# Altium schematic sheet jitx-top.SchDoc
size 558 x 431 mm
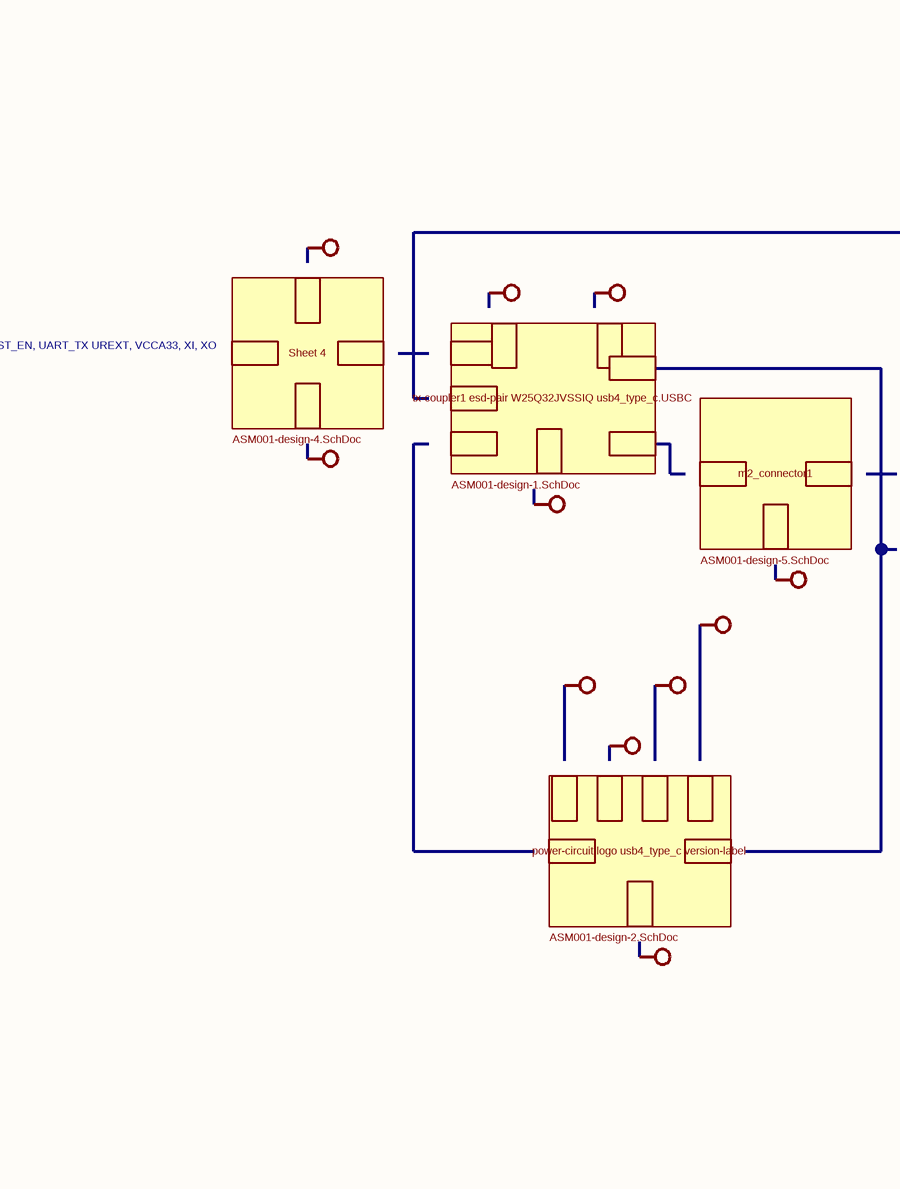
[diagram p0: jitx-top.SchDoc, centre column 2 of 4]
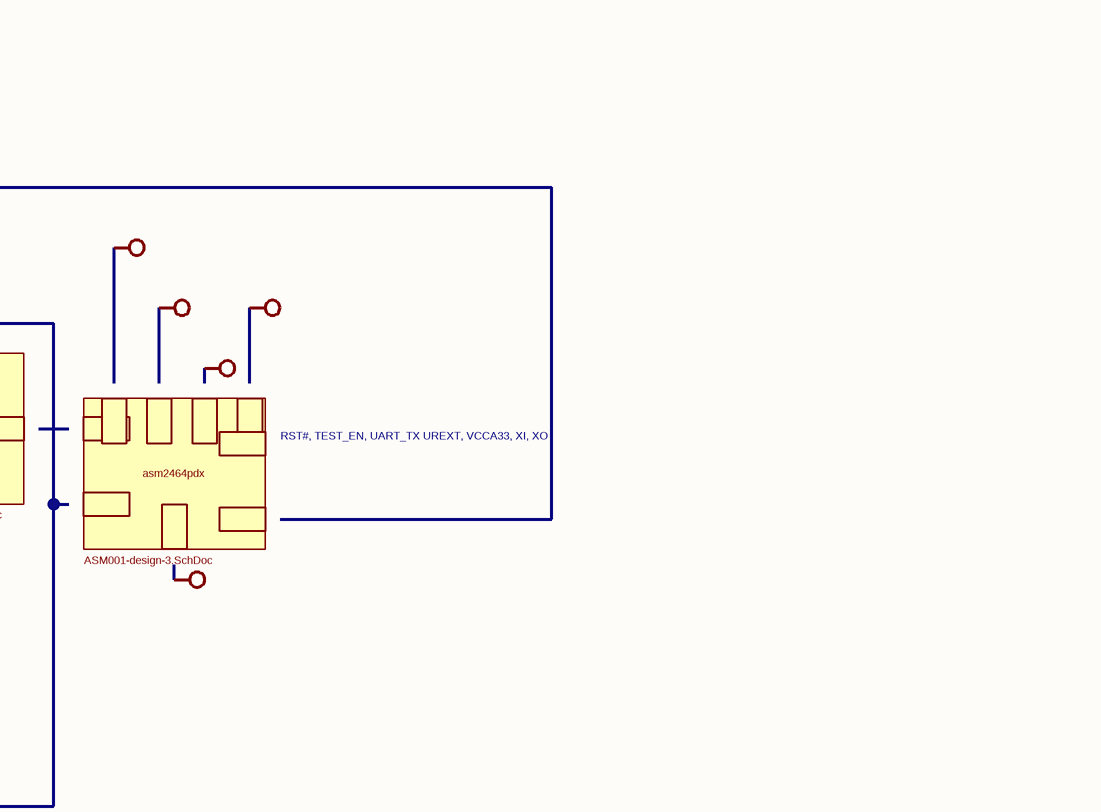
[diagram p1: jitx-top.SchDoc, centre column 3 of 4]
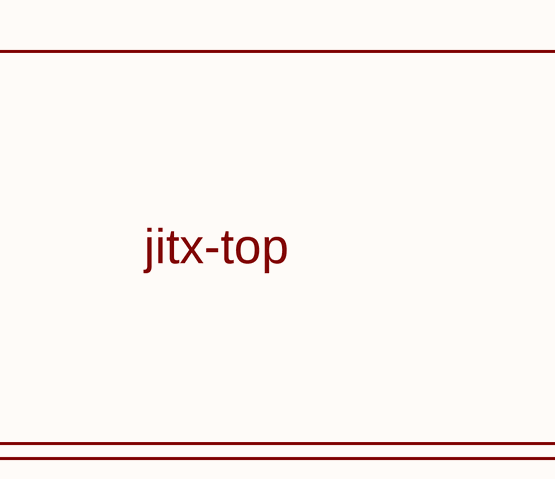
[diagram p2: jitx-top.SchDoc, bottom column 4 of 4]

## Sub-sheets
asm2464pdx = ASM001-design-3.SchDoc: , , , , , , , , 
m2_connector1 = ASM001-design-5.SchDoc: , , 
power-circuit
logo
usb4_type_c
version-label = ASM001-design-2.SchDoc: , , , , , , 
Sheet 4 = ASM001-design-4.SchDoc: , , , 
tx-coupler1
esd-pair
W25Q32JVSSIQ
usb4_type_c.USBC = ASM001-design-1.SchDoc: , , , , , , , 

## Notes on the sheet
- jitx-top
- Labels drawn without touching a wire or pin: RST#, TEST_EN, UART_TX
UREXT, VCCA33, XI, XO